# Altium project NODE_Daughter_Board_rev_16.PrjPcb
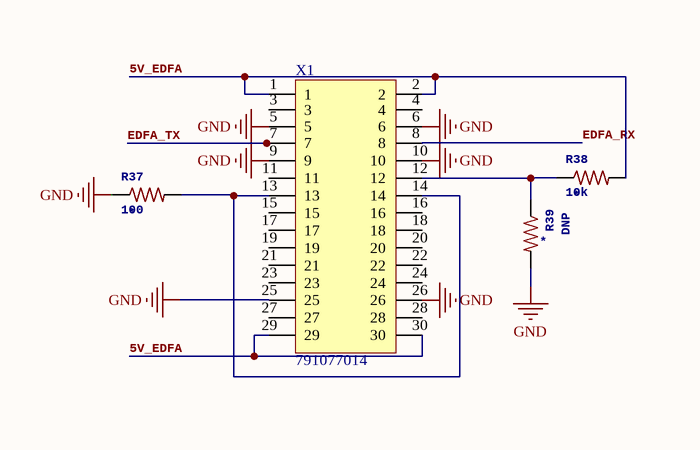
[diagram p0: EDFA Connector.SchDoc]
6 sheets, 213 parts. Net scope: global (net labels, ports and power ports of the same name join across sheets).
Board file: Daughter Board.PcbDoc
Sheets:
  EDFA Connector.SchDoc
  HV Power Supply.SchDoc
  Heater & Cal. Laser.SchDoc
  Seed Laser Controller.SchDoc
  FPGA Connect.SchDoc
  RTDBank.SchDoc

## Sheet EDFA Connector.SchDoc
size 99 x 63 mm

### Parts
R37  100  [0603R]
R38  10k  [0603R]
R39  DNP  [0603R]
X1  791077014  [791077014]

### Nets
GND: R37.1 R39.2 X1.5 X1.6 X1.9 X1.10 X1.25 X1.26
5V_EDFA: R38.2 X1.1 X1.2 X1.29 X1.30
EDFA_RX: X1.8
EDFA_TX: X1.7
NetR37_2: R37.2 X1.13 X1.14
NetR38_1: R38.1 R39.1 X1.12

Not connected (* = marked no-connect by the designer): X1 3 4 11 15 16 17 18 19 20 21 22 23 24 27 28

### Library data of the parts
R37-R39 = R-US_R0603: RESISTOR, American symbol; GateName_1: G$1; SymbolName_1: R-US; DeviceName: R0603; DeviceSetName: R-US_; LibraryName: rcl; NAME: *

## Sheet HV Power Supply.SchDoc
size 333 x 254 mm
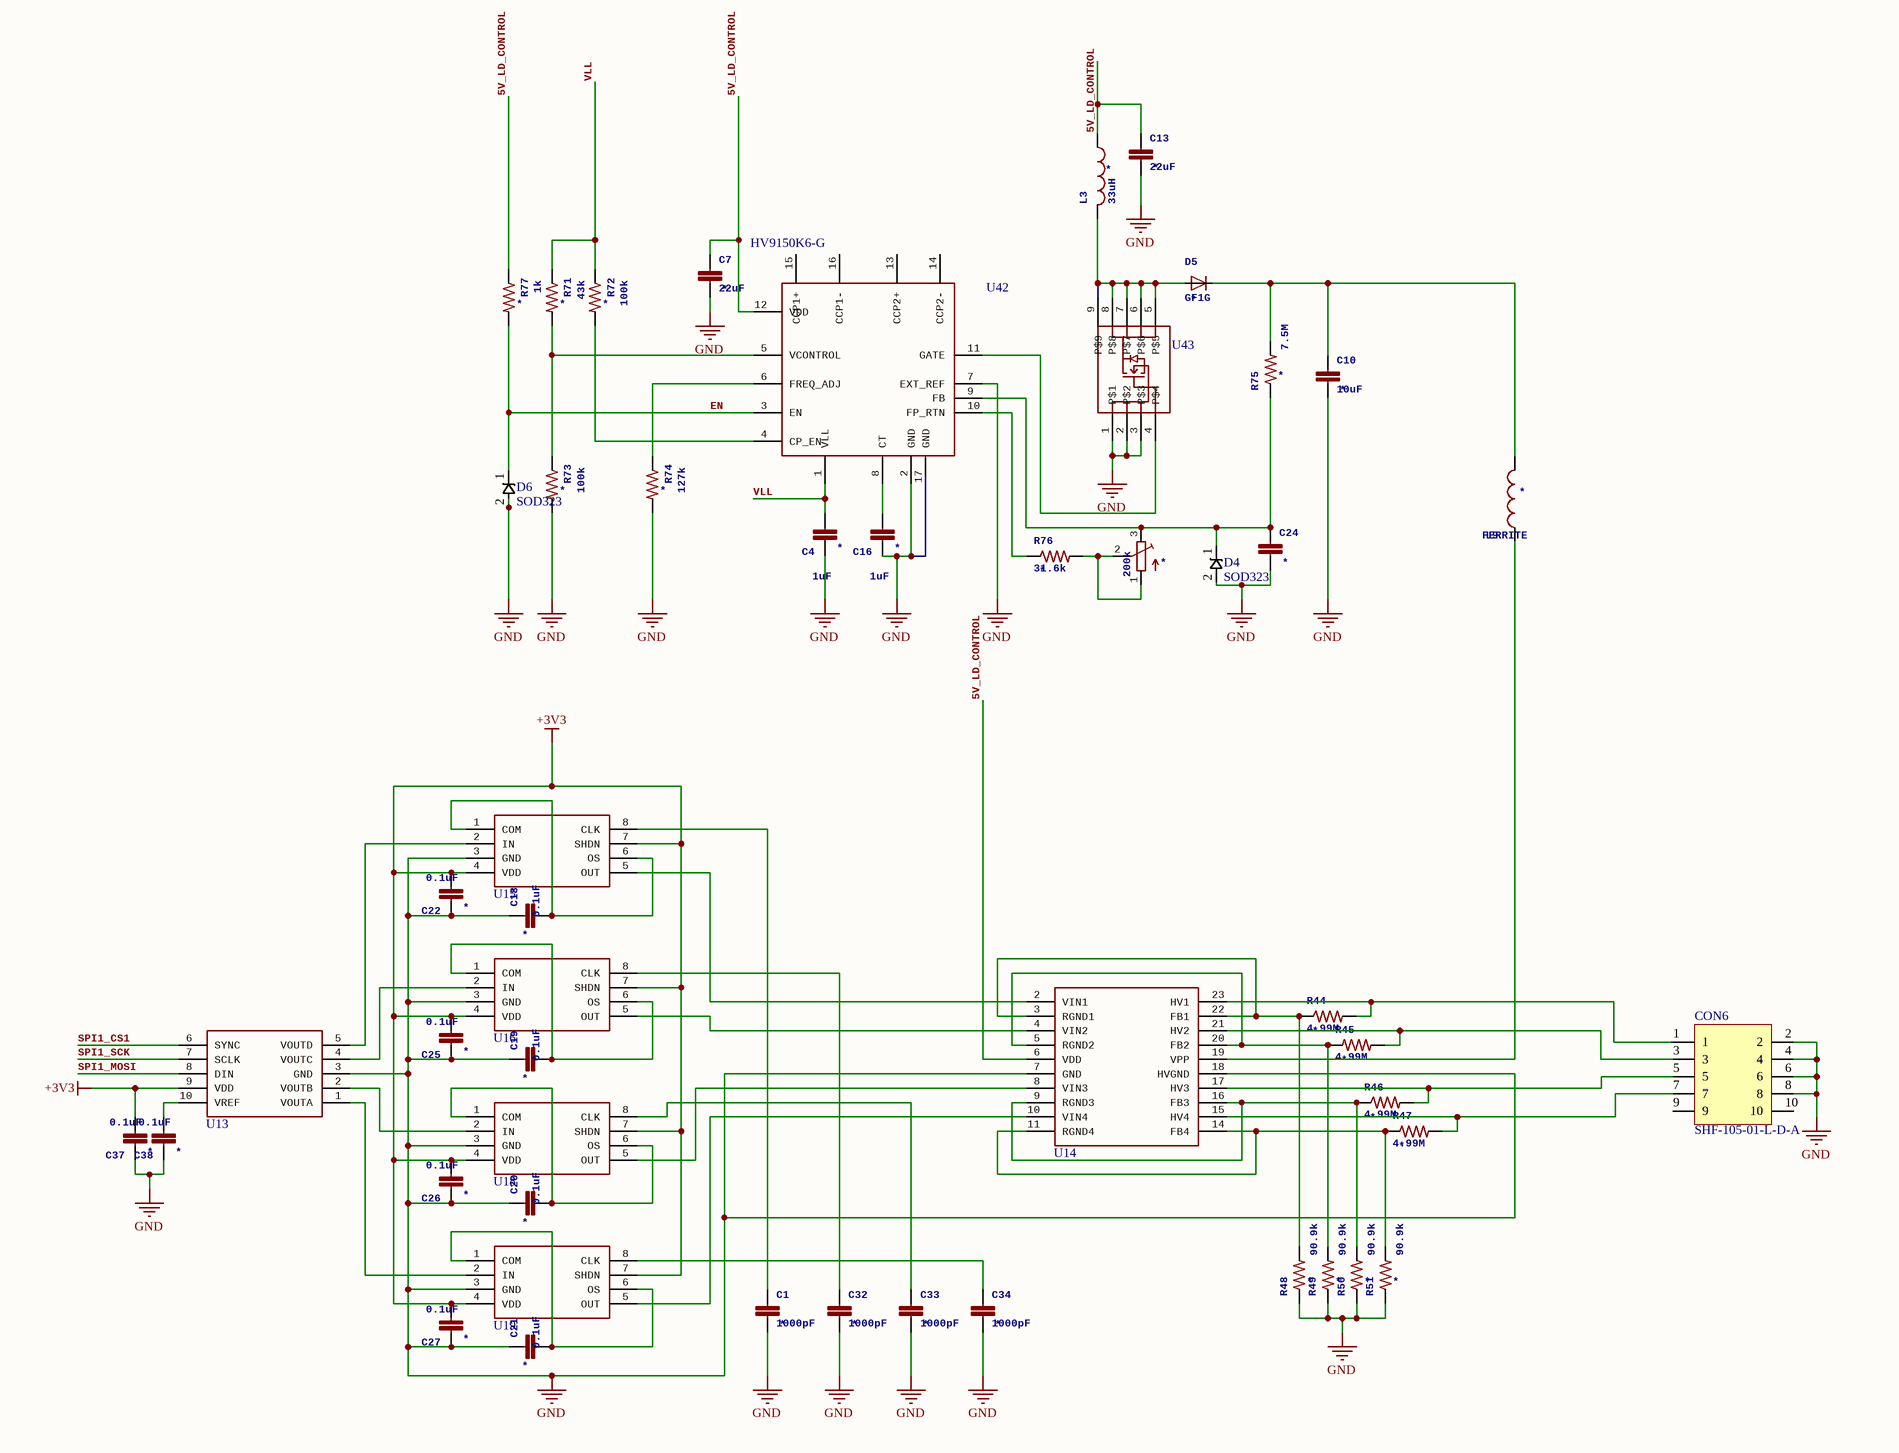
[diagram p1: HV Power Supply.SchDoc]

### Parts
C1  1000pF  [0402 B]
C4  1uF  [0603]
C7  22uF  [0603]
C10  10uF  [C1812]
C13  22uF  [0603]
C16  1uF  [0603]
C18  0.1uF  [0402 B]
C19  0.1uF  [0402 B]
C20  0.1uF  [0402 B]
C21  0.1uF  [0402 B]
C22  0.1uF  [0402 B]
C24  C-EUC0603  [0603]  (value not drawn)
C25  0.1uF  [0402 B]
C26  0.1uF  [0402 B]
C27  0.1uF  [0402 B]
C32  1000pF  [0402 B]
C33  1000pF  [0402 B]
C34  1000pF  [0402 B]
C37  0.1uF  [0402 B]
C38  0.1uF  [0402 B]
CON6  SHF-105-01-L-D-A  [SHF-105-01-L-D-RA]
D4  SOD323  [SOD-323]
D5  GF1G  [DO-214BA]
D6  SOD323  [SOD-323]
L3  33uH  [L1812]
L9  FERRITE  [0603]
R44  4.99M  [0603R]
R45  4.99M  [0603R]
R46  4.99M  [0603R]
R47  4.99M  [0603R]
R48  90.9k  [0603R]
R49  90.9k  [0603R]
R50  90.9k  [0603R]
R51  90.9k  [0603R]
R71  43k  [0603R]
R72  100k  [0603R]
R73  100k  [0603R]
R74  127k  [0603R]
R75  7.5M  [1206R]
R76  31.6k  [0603R]
R77  1k  [0603R]
U13  AD5664R  [MSOP-10]  (value not drawn)
U14  HV264TS-G  [TSSOP-24]  (value not drawn)
U15  MAX7413  [uMAX-8]  (value not drawn)
U16  MAX7413  [uMAX-8]  (value not drawn)
U18  MAX7413  [uMAX-8]  (value not drawn)
U19  MAX7413  [uMAX-8]  (value not drawn)
U42  HV9150K6-G  [QFN-16]
U43  BSZ42DN25NS3GATMA1  [TDSON-8]  (value not drawn)
U44  200k  [TC33X]

### Nets
5V_LD_CONTROL: C7.1 C13.1 L3.1 R77.1 U14.6(VDD) U42.12(VDD)
+3V3: C22.2 C25.2 C26.2 C27.2 C37.2 U13.9(VDD) U15.4(VDD) U15.7(SHDN) U16.4(VDD) U16.7(SHDN) U18.4(VDD) U18.7(SHDN) U19.4(VDD) U19.7(SHDN)
GND: C1.2 C4.1 C7.2 C10.2 C13.2 C16.1 C18.1 C19.1 C20.1 C21.1 C22.1 C24.2 C25.1 C26.1 C27.1 C32.2 C33.2 C34.2 C37.1 C38.1 CON6.2 CON6.4 CON6.6 CON6.8 D4.2 D6.2 R48.1 R49.1 R50.1 R51.1 R73.2 R74.2 U13.3(GND) U14.7(GND) U14.18(HVGND) U15.3(GND) U16.3(GND) U18.3(GND) U19.3(GND) U42.2(GND) U42.7(EXT_REF) U42.17(GND) U43.1(P$1) U43.2(P$2) U43.3(P$3)
EN: D6.1 R77.2 U42.3(EN)
SPI1_CS1: U13.6(SYNC)
SPI1_MOSI: U13.8(DIN)
SPI1_SCK: U13.7(SCLK)
VLL: C4.2 R71.1 R72.1 U42.1(VLL)
NetC1_1: C1.1 U15.8(CLK)
NetC10_1: C10.1 D5.2 L9.2 R75.2
NetC16_2: C16.2 U42.8(CT)
NetC18_2: C18.2 U15.1(COM) U15.6(OS)
NetC19_2: C19.2 U16.1(COM) U16.6(OS)
NetC20_2: C20.2 U18.1(COM) U18.6(OS)
NetC21_2: C21.2 U19.1(COM) U19.6(OS)
NetC24_1: C24.1 D4.1 R75.1 U42.9(FB) U44.3(E)
NetC32_1: C32.1 U16.8(CLK)
NetC33_1: C33.1 U18.8(CLK)
NetC34_1: C34.1 U19.8(CLK)
NetC38_2: C38.2 U13.10(VREF)
NetCON6_1: CON6.1 R44.2 U14.23(HV1)
NetCON6_3: CON6.3 R45.2 U14.21(HV2)
NetCON6_5: CON6.5 R46.2 U14.17(HV3)
NetCON6_7: CON6.7 R47.2 U14.15(HV4)
NetD5_1: D5.1 L3.2 U43.5(P$5) U43.6(P$6) U43.7(P$7) U43.8(P$8) U43.9(P$9)
NetL9_1: L9.1 U14.19(VPP)
NetR44_1: R44.1 R48.2 U14.3(RGND1) U14.22(FB1)
NetR45_1: R45.1 R49.2 U14.5(RGND2) U14.20(FB2)
NetR46_1: R46.1 R50.2 U14.9(RGND3) U14.16(FB3)
NetR47_1: R47.1 R51.2 U14.11(RGND4) U14.14(FB4)
NetR71_2: R71.2 R73.1 U42.5(VCONTROL)
NetR72_2: R72.2 U42.4(CP_EN)
NetR74_1: R74.1 U42.6(FREQ_ADJ)
NetR76_1: R76.1 U42.10(FP_RTN)
NetR76_2: R76.2 U44.1(A) U44.2(S)
NetU13_1: U13.1(VOUTA) U19.2(IN)
NetU13_2: U13.2(VOUTB) U18.2(IN)
NetU13_4: U13.4(VOUTC) U16.2(IN)
NetU13_5: U13.5(VOUTD) U15.2(IN)
NetU14_2: U14.2(VIN1) U15.5(OUT)
NetU14_4: U14.4(VIN2) U16.5(OUT)
NetU14_8: U14.8(VIN3) U18.5(OUT)
NetU14_10: U14.10(VIN4) U19.5(OUT)
NetU42_11: U42.11(GATE) U43.4(P$4)

Not connected (* = marked no-connect by the designer): CON6 9 10; U42 13(CCP2+) 14(CCP2-) 15(CCP1+) 16(CCP1-)

### Library data of the parts
C1 C18-C22 C25-C27 C32-C34 C37 C38 = CAP_0402: 0402 (1005 Metric) Nick Garner - TeleSense; GateName_1: G$1; SymbolName_1: CAP; LibraryName: Perfect_0402; DeviceSetName: CAP_0402; NAME: *
C4 C7 C13 C16 C24 = C-EUC0603: CAPACITOR, European symbol; GateName_1: G$1; SymbolName_1: C-EU; DeviceName: C0603; LibraryName: rcl; DeviceSetName: C-EU; NAME: *
C10 = C-EUC1812: CAPACITOR, European symbol; GateName_1: G$1; SymbolName_1: C-EU; DeviceName: C1812; LibraryName: rcl; DeviceSetName: C-EU; NAME: *
D5 = GF1: DIODE; GateName_1: D; SymbolName_1: D-1; LibraryName: diode; DeviceSetName: GF1; NAME: *
L3 = L-USL1812: INDUCTOR, American symbol; GateName_1: G$1; SymbolName_1: L-US; DeviceName: L1812; LibraryName: resistor; DeviceSetName: L-US; NAME: *
L9 = INDUCTOR30OHM,1.8A: InductorsBasic Inductor/Choke - 0603 and 1206. Footprints are not proven and vary greatly between part numbers.SRN6045- 33uH, 20% 1.4ASDR0403-560KL - 56uH, 10%, 500mA RMS/740mA peak; GateName_1: G$1; PROD_ID: RES-07859; SymbolName_1: INDUCTOR; DeviceName: 30OHM,1.8A; LibraryName: SparkFun-Passives; DeviceSetName: INDUCTOR; NAME: *
R44-R51 R71-R74 R76 R77 = R-US_R0603: as R37 on sheet EDFA Connector; LibraryName: rcl; NAME: *
R75 = R-US_R1206: RESISTOR, American symbol; GateName_1: G$1; SymbolName_1: R-US; DeviceName: R1206; DeviceSetName: R-US_; LibraryName: rcl; NAME: *
U13 = AD5664R: GateName_1: G$1; SymbolName_1: AD5664R; LibraryName: custom; DeviceSetName: AD5664R
U14 = HV264: GateName_1: G$1; SymbolName_1: HV264; LibraryName: custom; DeviceSetName: HV264
U15 U16 U18 U19 = MAX7413: GateName_1: G$1; SymbolName_1: MAX7413; LibraryName: custom; DeviceSetName: MAX7413
U42 = HV9150: GateName_1: G$1; SymbolName_1: HV9150; LibraryName: custom; DeviceSetName: HV9150
U43 = BSZ42DN25NS3: GateName_1: G$1; SymbolName_1: BSZ42DN25NS3; LibraryName: custom; DeviceSetName: BSZ42DN25NS3
U44 = TRIMPOTTC33X: SMT trimmer potentiometer part number TC33X http://www.ladyada.net/library/eagle; GateName_1: G$1; SymbolName_1: TRIMPOT; DeviceName: TC33X; LibraryName: adafruit; DeviceSetName: TRIMPOT; NAME: *

## Sheet Heater & Cal. Laser.SchDoc
size 214 x 146 mm
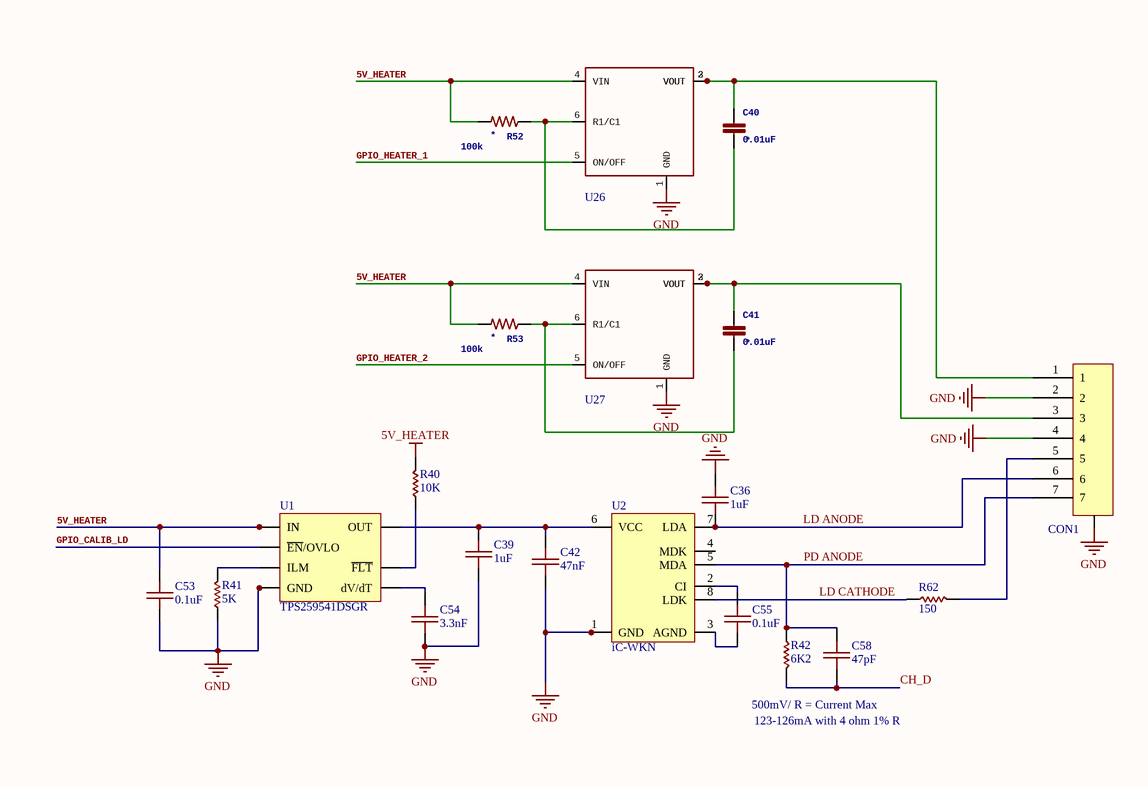
[diagram p2: Heater & Cal. Laser.SchDoc]

### Parts
C36  1uF  [0402 B]
C39  1uF  [0402 B]
C40  0.01uF  [0603]
C41  0.01uF  [0603]
C42  47nF  [0402 B]
C53  0.1uF  [0402 B]
C54  3.3nF  [0402 B]
C55  0.1uF  [0402 B]
C58  47pF  [0402 B]
CON1  T1M-07-F-SH-L-K_1  [T1M-07-F-SH-L-K]  (value not drawn)
R40  10K  [0402]
R41  5K  [0402]
R42  6K2  [0402R]
R52  100k  [0603R]
R53  100k  [0603R]
R62  150  [0402R]
U1  TPS259541DSGR  [SON8 (2x2)]
U2  iC-WKN  [SOIC8tp]
U26  TPS27082L  [TSOT-23 6 Lead]  (value not drawn)
U27  TPS27082L  [TSOT-23 6 Lead]  (value not drawn)

### Nets
5V_HEATER: C53.2 R40.1 R52.2 R53.2 U1.3(IN) U1.4(IN) U26.4(VIN) U27.4(VIN)
GND: C36.2 C39.1 C42.1 C53.1 C54.1 CON1.2 CON1.4 CON1.GND R41.2 U1.8(GND) U1.9 U2.1(GND) U2.9 U26.1(GND) U27.1(GND)
CH_D: C58.1 R42.1
GPIO_CALIB_LD: U1.2(~{EN}/OVLO)
GPIO_HEATER_1: U26.5(ON/OFF)
GPIO_HEATER_2: U27.5(ON/OFF)
LD ANODE: C36.1 CON1.6 U2.7(LDA)
LD CATHODE: R62.2 U2.8(LDK)
PD ANODE: C58.2 CON1.7 R42.2 U2.5(MDA)
NetC39_2: C39.2 C42.2 U1.5(OUT) U2.6(VCC)
NetC40_1: C40.1 CON1.1 U26.2(VOUT) U26.3(VOUT)
NetC40_2: C40.2 R52.1 U26.6(R1/C1)
NetC41_1: C41.1 CON1.3 U27.2(VOUT) U27.3(VOUT)
NetC41_2: C41.2 R53.1 U27.6(R1/C1)
NetC54_2: C54.2 U1.1(dV/dT)
NetC55_1: C55.1 U2.3(AGND)
NetC55_2: C55.2 U2.2(CI)
NetCON1_5: CON1.5 R62.1
NetR40_2: R40.2 U1.6(~{FLT})
NetR41_1: R41.1 U1.7(ILM)

Not connected (* = marked no-connect by the designer): U2 4(MDK)

### Notes on the sheet
- 500mV/ R = Current Max
- 123-126mA with 4 ohm 1% R

### Library data of the parts
C36 C39 C42 C53-C55 C58 = CAP 0402: 402 Capacitor
C40 C41 = C-EUC0603K: CAPACITOR, European symbol; GateName_1: G$1; SymbolName_1: C-EU; DeviceName: C0603K; LibraryName: rcl; DeviceSetName: C-EU; NAME: *
CON1 = T1M-07-F-SH-L-K_1: 6 Positions Header Connector Surface Mount, Right Angle; Manufacturer: Samtec; Manufacturer Part Number: T1M-06-F-SH-L-K; Supplier 1: Digi-Key; Stock 1: 0; Supplier Part Number 1: SAM11991-ND
R40-R42 R62 = RES 0402: 402 Resistor
R52 R53 = R-US_R0603: as R37 on sheet EDFA Connector; LibraryName: rcl; NAME: *
U1 = TPS2595x3
U26 U27 = TPS27082L: GateName_1: G$1; SymbolName_1: TPS27082L; LibraryName: custom; DeviceSetName: TPS27082L

## Sheet Seed Laser Controller.SchDoc
size 267 x 211 mm
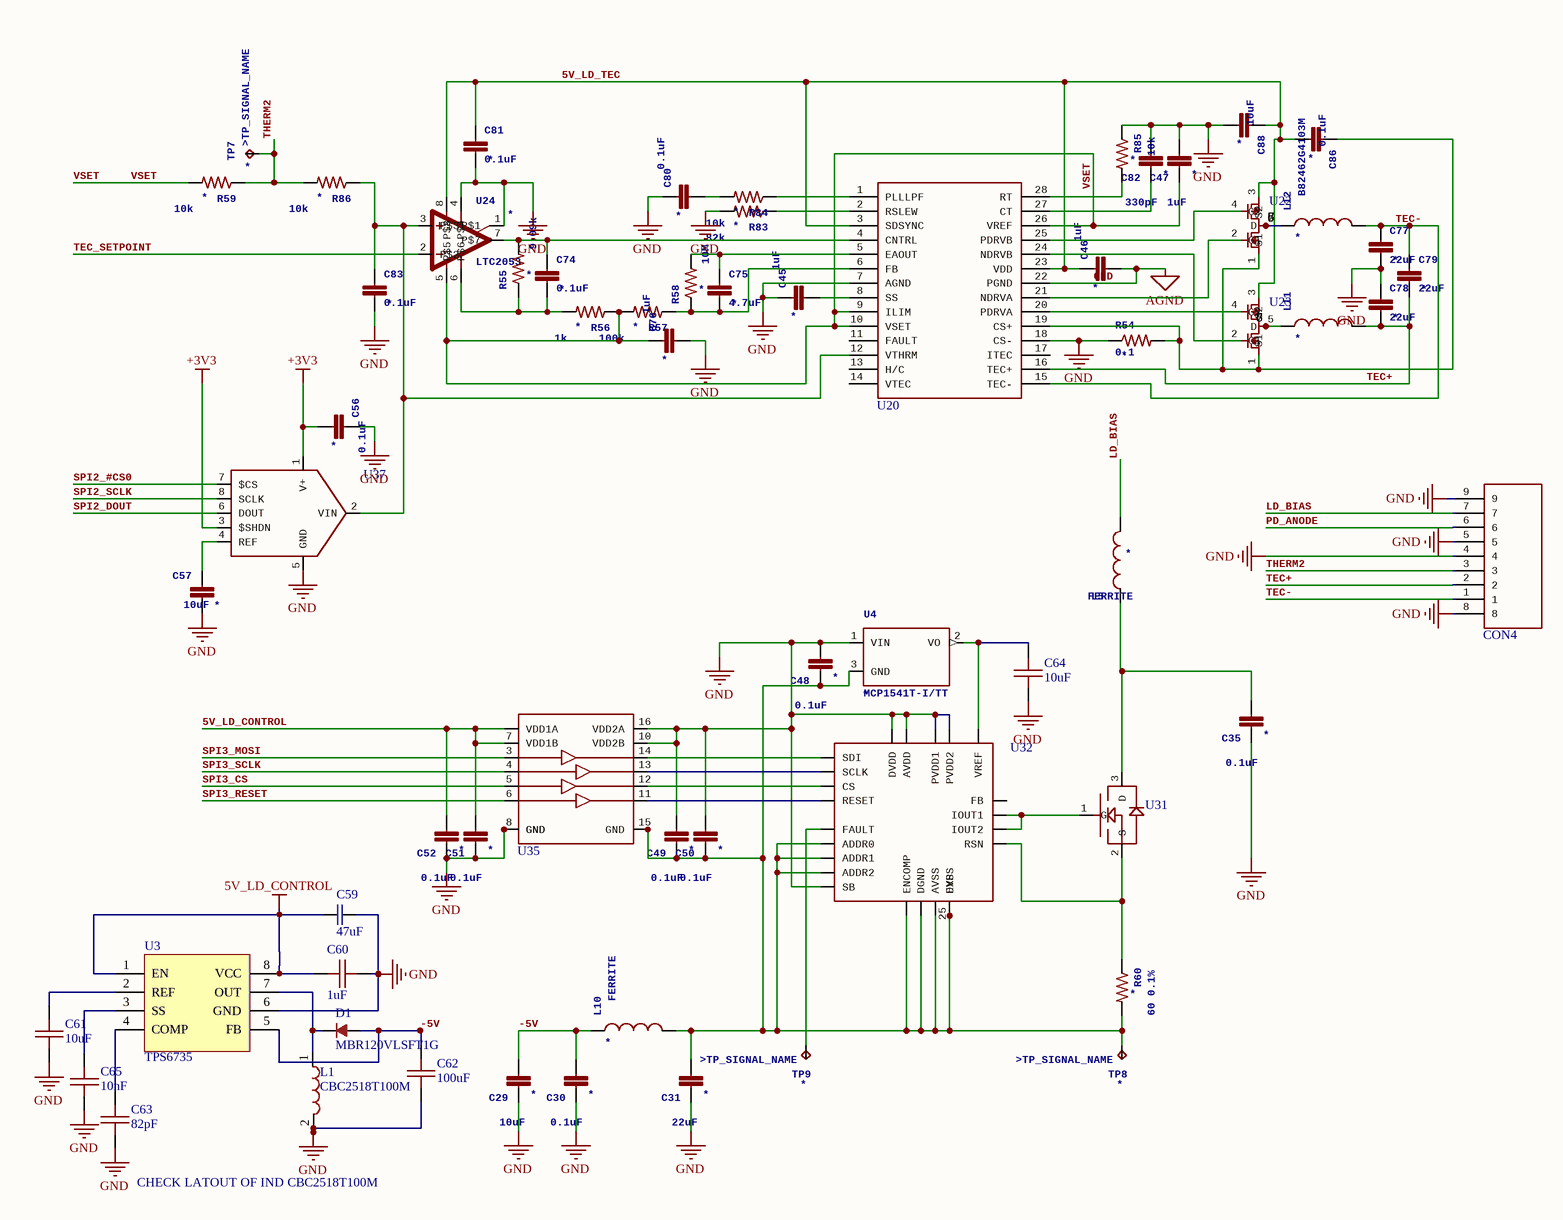
[diagram p3: Seed Laser Controller.SchDoc]

### Parts
C29  10uF  [0603]
C30  0.1uF  [0603]
C31  22uF  [0603]
C35  0.1uF  [0603]
C45  1uF  [0402]
C46  1uF  [0402]
C47  1uF  [0402]
C48  0.1uF  [0402 B]
C49  0.1uF  [0402 B]
C50  0.1uF  [0402 B]
C51  0.1uF  [0402 B]
C52  0.1uF  [0402 B]
C56  0.1uF  [0402]
C57  10uF  [0603]
C59  47uF  [0603]
C60  1uF  [0402 B]
C61  10uF  [0402 B]
C62  100uF  [1206 B]
C63  82pF  [0402 B]
C64  10uF  [0402 B]
C65  10nF  [0402 B]
C74  0.1uF  [0603]
C75  4.7uF  [0603]
C76  1uF  [0402]
C77  22uF  [0402]
C78  22uF  [0402]
C79  22uF  [0603]
C80  0.1uF  [0402]
C81  0.1uF  [0603]
C82  330pF  [0402]
C83  0.1uF  [0402]
C86  0.1uF  [0402]
C88  10uF  [0603]
CON4  SAMTEC_T1M_X7  [T1M-07-F-SH-L-K]  (value not drawn)
D1  MBR120VLSFT1G  [SOD123FL]
L1  CBC2518T100M  [1007]
L5  FERRITE  [0603R]
L10  FERRITE  [0603R]
L11  B82462G4103M  [B82462G]  (value not drawn)
L12  B82462G4103M  [B82462G]
R54  0.1  [1206R]
R55  9.09k  [0603R]
R56  1k  [0603R]
R57  100k  [0603R]
R58  10M  [0603R]
R59  10k  [0603R]
R60  60 0.1%  [0603R]
R83  82k  [0402R]
R84  10k  [0402R]
R85  10k  [0402R]
R86  10k  [0603R]
TP7  TP_SIGNAL_NAME: >TP_SIGNAL_NAME  [B1,27]  (hidden comment: TPB1,27)
TP8  TP_SIGNAL_NAME: >TP_SIGNAL_NAME  [B1,27]  (hidden comment: TPB1,27)
TP9  TP_SIGNAL_NAME: >TP_SIGNAL_NAME  [B1,27]  (hidden comment: TPB1,27)
U3  TPS6735  [SOIC8]
U4  MCP1541T-I/TT  [SOT-23]
U20  LTC1923SSOP28  [SSOP-28]  (value not drawn)
U22  SI9801DY  [SOIC8]  (value not drawn)
U23  SI9801DY  [SOIC8]  (value not drawn)
U24  LTC2053  [MSOP8]
U31  SI2334DS  [SOT-23]  (value not drawn)
U32  ADN8810ACPZ  [LFCSP-24]  (value not drawn)
U35  ADUM7440  [QSOP16]  (value not drawn)
U37  MAX1240  [SOIC8]  (value not drawn)

### Nets
5V_LD_CONTROL: C51.2 C52.2 C59.1 C60.2 U3.1(EN) U3.8(VCC) U35.1(VDD1A) U35.7(VDD1B)
+3V3: C56.2 U37.1(V+) U37.3($SHDN)
GND: C29.1 C30.1 C31.1 C35.1 C45.1 C46.2 C47.2 C48.2 C49.2 C50.2 C51.1 C52.1 C56.1 C57.2 C59.2 C60.1 C61.1 C62.1 C63.1 C64.1 C65.1 C76.2 C77.2 C78.1 C80.1 C81.2 C82.2 C83.2 C88.2 CON4.4 CON4.5 CON4.8 CON4.9 L1.2 R54.1 R83.2 R85.1 U3.6(GND) U4.1(VIN) U20.7(AGND) U20.18(CS-) U20.22(PGND) U24.1(P$1) U24.4(P$4) U32.7(SB) U32.8(PVDD1) U32.11(PVDD2) U32.15(AVDD) U32.23(DVDD) U35.2(GND) U35.8(GND) U35.10(VDD2B) U35.16(VDD2A) U37.5(GND)  [also labelled AGND]
5V_LD_TEC: C46.1 C81.1 C86.2 C88.1 U20.3(SDSYNC) U20.23(VDD) U22.3(S2) U23.3(S2) U24.8(P$8)
-5V: C29.2 C30.2 C62.2 D1.2(A) L10.1 U3.5(FB)
LD_BIAS: CON4.7 L5.2
PD_ANODE: CON4.6
SPI2_#CS0: U37.7($CS)
SPI2_DOUT: U37.6(DOUT)
SPI2_SCLK: U37.8(SCLK)
SPI3_CS: U35.5(P$5)
SPI3_MOSI: U35.3(P$3)
SPI3_RESET: U35.6(P$6)
SPI3_SCLK: U35.4(P$4)
TEC+: C78.2 C79.2 CON4.2 L11.P$2 U20.16(TEC+)
TEC-: C77.1 C79.1 CON4.1 L12.P$2 U20.15(TEC-)
TEC_SETPOINT: U24.2(P$2)
THERM2: CON4.3 R59.1 R86.2 TP7.TP
VSET: C47.1 C76.1 R56.1 R57.2 R59.2 U20.9(ILIM) U20.10(VSET) U20.26(VREF) U24.5(P$5)
NetC31_2: C31.2 C48.1 C49.1 C50.1 L10.2 R60.2 TP8.TP U4.3(GND) U32.1(ADDR2) U32.4(ADDR1) U32.5(ADDR0) U32.12(ENCOMP) U32.16(AVSS) U32.18(DVSS) U32.24(DGND) U32.25(EXP) U35.9(GND) U35.15(GND)
NetC35_2: C35.2 L5.1 U31.3(D)
NetC45_2: C45.2 U20.8(SS)
NetC57_1: C57.1 U37.4(REF)
NetC61_2: C61.2 U3.2(REF)
NetC63_2: C63.2 U3.4(COMP)
NetC64_2: C64.2 U4.2(VO) U32.14(VREF)
NetC65_2: C65.2 U3.3(SS)
NetC74_1: C74.1 R55.2 U20.4(CNTRL) U24.7(P$7)
NetC74_2: C74.2 R55.1 R56.2 U24.6(P$6)
NetC75_1: C75.1 R58.2 U20.5(EAOUT)
NetC75_2: C75.2 R57.1 R58.1 U20.6(FB)
NetC80_2: C80.2 R84.2
NetC82_1: C82.1 U20.27(CT)
NetC83_1: C83.1 R86.1 U20.12(VTHRM) U24.3(P$3) U37.2(VIN)
NetC86_1: C86.1 R54.2 U20.19(CS+) U22.1(S1) U23.1(S1)
NetD1_1: D1.1(K) L1.1 U3.7(OUT)
NetL11_P$1: L11.P$1 U23.5(D) U23.6(D) U23.7(D) U23.8(D)
NetL12_P$1: L12.P$1 U22.5(D) U22.6(D) U22.7(D) U22.8(D)
NetR60_1: R60.1 U31.2(S) U32.2(RSN)
NetR83_1: R83.1 U20.2(RSLEW)
NetR84_1: R84.1 U20.1(PLLLPF)
NetR85_2: R85.2 U20.28(RT)
NetTP9_TP: TP9.TP U32.6(FAULT)
NetU20_20: U20.20(PDRVA) U23.4(G2)
NetU20_21: U20.21(NDRVA) U22.2(G1)
NetU20_24: U20.24(NDRVB) U23.2(G1)
NetU20_25: U20.25(PDRVB) U22.4(G2)
NetU31_1: U31.1(G) U32.9(IOUT1) U32.10(IOUT2)
NetU32_19: U32.19(SDI) U35.14(P$14)
NetU32_20: U32.20(SCLK) U35.13(P$13)
NetU32_21: U32.21(CS) U35.12(P$12)
NetU32_22: U32.22(RESET) U35.11(P$11)

Not connected (* = marked no-connect by the designer): U20 11(FAULT) 13(H/C) 14(VTEC) 17(ITEC); U32 3(FB)

### Notes on the sheet
- CHECK LATOUT OF IND CBC2518T100M

### Library data of the parts
C29-C31 C35 C57 C88 = C-EUC0603K: as C40 on sheet Heater & Cal. Laser; LibraryName: rcl; DeviceSetName: C-EU; NAME: *
C45-C52 C76-C78 C80-C83 C86 = C-EUC0402: CAPACITOR, European symbol; GateName_1: G$1; SymbolName_1: C-EU; DeviceName: C0402; LibraryName: rcl; DeviceSetName: C-EU; NAME: *
C56 = C-EUC0402K: CAPACITOR, European symbol; GateName_1: G$1; SymbolName_1: C-EU; DeviceName: C0402K; LibraryName: rcl; DeviceSetName: C-EU; NAME: *
C59 = Cap 0603
C60 C61 C63-C65 = CAP 0402: 402 Capacitor
C62 = CAP 1206: 1206 Capacitor
C74 C75 C79 = C-EUC0603: as C4 on sheet HV Power Supply; LibraryName: rcl; DeviceSetName: C-EU; NAME: *
CON4 = SAMTEC_T1M_X7: GateName_1: G$1; SymbolName_1: SAMTEC_T1M_X7; LibraryName: custom; DeviceSetName: SAMTEC_T1M_X7
D1 = MBR120VLSFT1G: DIODE SCHOTTKY 20V 1A
L5 L10 = INDUCTOR0603: InductorsBasic Inductor/Choke - 0603 and 1206. Footprints are not proven and vary greatly between part numbers.SRN6045- 33uH, 20% 1.4ASDR0403-560KL - 56uH, 10%, 500mA RMS/740mA peak; GateName_1: G$1; DeviceName: 0603; SymbolName_1: INDUCTOR; LibraryName: SparkFun-Passives; DeviceSetName: INDUCTOR; NAME: *
L11 L12 = INDUCTOR-B82462G: 10uH; GateName_1: G$1; SymbolName_1: INDUCTOR; DeviceName: -B82462G; LibraryName: SparkFun-Passives; DeviceSetName: INDUCTOR; NAME: *
R54 = R-US_R1206: as R75 on sheet HV Power Supply; LibraryName: rcl; NAME: *
R55-R60 R86 = R-US_R0603: as R37 on sheet EDFA Connector; LibraryName: rcl; NAME: *
R83-R85 = R-US_R0402: RESISTOR, American symbol; GateName_1: G$1; SymbolName_1: R-US; DeviceName: R0402; DeviceSetName: R-US_; LibraryName: rcl; NAME: *
TP7-TP9 = TPB1,27: Test pad; GateName_1: G$1; SymbolName_1: TP; DeviceName: B1,27; LibraryName: testpad; DeviceSetName: TP; NAME: *
U4 = MC15*TT: 2.5V and 4.096V Voltage ReferencesSource: http://www.microchip.com .. 21653b.pdf; GateName_1: G$1; SymbolName_1: MCP1525; DeviceName: TT; DeviceSetName: MC15*; LibraryName: microchip; MF: *; MPN: *; NAME: *; OC_FARNELL: unknown; OC_NEWARK: unknown
U20 = LTC1923SSOP28: GateName_1: G$1; DeviceName: SSOP28; SymbolName_1: LTC1923; LibraryName: custom; DeviceSetName: LTC1923
U22 U23 = SI9801DY: GateName_1: G$1; SymbolName_1: SI9801DY; LibraryName: custom; DeviceSetName: SI9801DY
U24 = LTC2053: GateName_1: G$1; SymbolName_1: LTC2053; LibraryName: custom; DeviceSetName: LTC2053; NAME: *
U31 = SI2334DS: GateName_1: G$1; SymbolName_1: N-CHANNEL; LibraryName: custom; DeviceSetName: SI2334DS
U32 = ADN8810: GateName_1: G$1; SymbolName_1: ADN8810; LibraryName: custom; DeviceSetName: ADN8810
U35 = ADUM7440: GateName_1: G$1; SymbolName_1: ADUM7440; LibraryName: custom; DeviceSetName: ADUM7440
U37 = MAX1240: GateName_1: G$1; SymbolName_1: MAX1240; LibraryName: custom; DeviceSetName: MAX1240

## Sheet FPGA Connect.SchDoc
size B
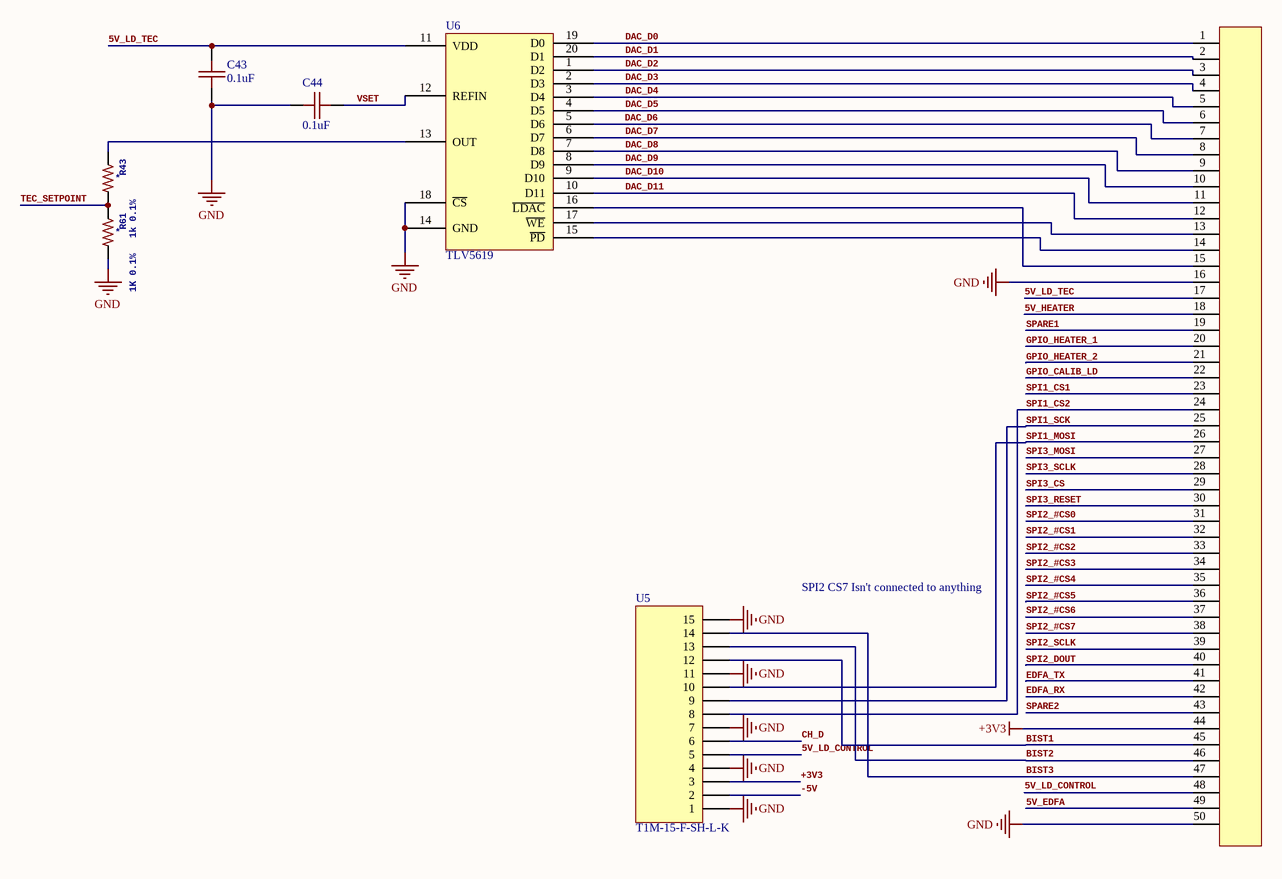
[diagram p4: FPGA Connect.SchDoc]

### Parts
C43  0.1uF  [0402 B]
C44  0.1uF  [0402 B]
CON5  (no value)  [LSEM-150-XX.X-X-DV-A-X-XX-TR]
R43  1k 0.1%  [0402R]
R61  1K 0.1%  [0402R]
U5  T1M-15-F-SH-L-K  [T1M-15-F-SH-L-K]
U6  TLV5619  [TSSOP-20]

### Nets
5V_HEATER: CON5.18
5V_LD_CONTROL: CON5.48 U5.5
+3V3: CON5.44 U5.3
GND: C43.2 C44.2 CON5.16 CON5.50 R61.2 U5.1 U5.4 U5.7 U5.11 U5.15 U6.14(GND) U6.18(~{CS})
5V_EDFA: CON5.49
5V_LD_TEC: C43.1 CON5.17 U6.11(VDD)
-5V: U5.2
BIST1: CON5.45 U5.12
BIST2: CON5.46 U5.13
BIST3: CON5.47 U5.14
CH_D: U5.6
DAC_D0: CON5.1 U6.19(D0)
DAC_D1: CON5.2 U6.20(D1)
DAC_D2: CON5.3 U6.1(D2)
DAC_D3: CON5.4 U6.2(D3)
DAC_D4: CON5.5 U6.3(D4)
DAC_D5: CON5.6 U6.4(D5)
DAC_D6: CON5.7 U6.5(D6)
DAC_D7: CON5.8 U6.6(D7)
DAC_D8: CON5.9 U6.7(D8)
DAC_D9: CON5.10 U6.8(D9)
DAC_D10: CON5.11 U6.9(D10)
DAC_D11: CON5.12 U6.10(D11)
EDFA_RX: CON5.42
EDFA_TX: CON5.41
GPIO_CALIB_LD: CON5.22
GPIO_HEATER_1: CON5.20
GPIO_HEATER_2: CON5.21
SPARE1: CON5.19
SPARE2: CON5.43
SPI1_CS1: CON5.23
SPI1_CS2: CON5.24 U5.8
SPI1_MOSI: CON5.26 U5.10
SPI1_SCK: CON5.25 U5.9
SPI2_#CS0: CON5.31
SPI2_#CS1: CON5.32
SPI2_#CS2: CON5.33
SPI2_#CS3: CON5.34
SPI2_#CS4: CON5.35
SPI2_#CS5: CON5.36
SPI2_#CS6: CON5.37
SPI2_#CS7: CON5.38
SPI2_DOUT: CON5.40
SPI2_SCLK: CON5.39
SPI3_CS: CON5.29
SPI3_MOSI: CON5.27
SPI3_RESET: CON5.30
SPI3_SCLK: CON5.28
TEC_SETPOINT: R43.2 R61.1
VSET: C44.1 U6.12(REFIN)
NetCON5_13: CON5.13 U6.17(~{WE})
NetCON5_14: CON5.14 U6.15(~{PD})
NetCON5_15: CON5.15 U6.16(~{LDAC})
NetR43_1: R43.1 U6.13(OUT)

### Notes on the sheet
- SPI2 CS7 Isn't connected to anything

### Library data of the parts
C43 C44 = CAP 0402: 402 Capacitor
CON5 = SAMTEC_LSEM_V_50: SAMTEC connector SAMTEC_LSEM_V_50
R43 R61 = R-US_R0603: as R37 on sheet EDFA Connector; LibraryName: rcl; NAME: *

## Sheet RTDBank.SchDoc
size 155 x 512 mm
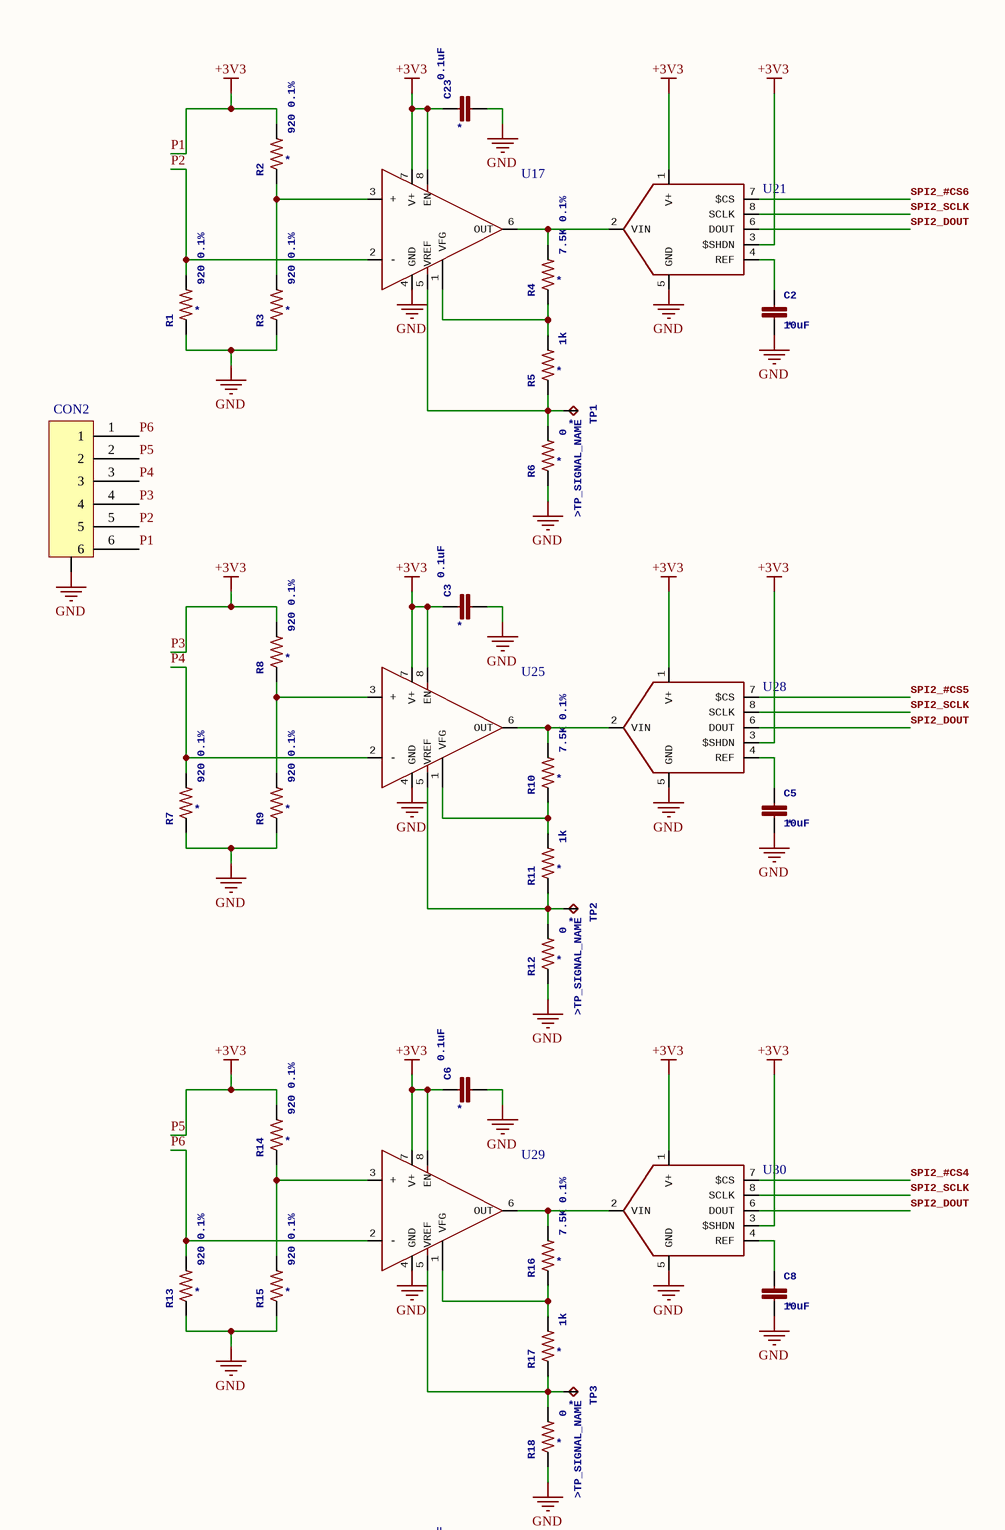
[diagram p5: RTDBank.SchDoc, top]
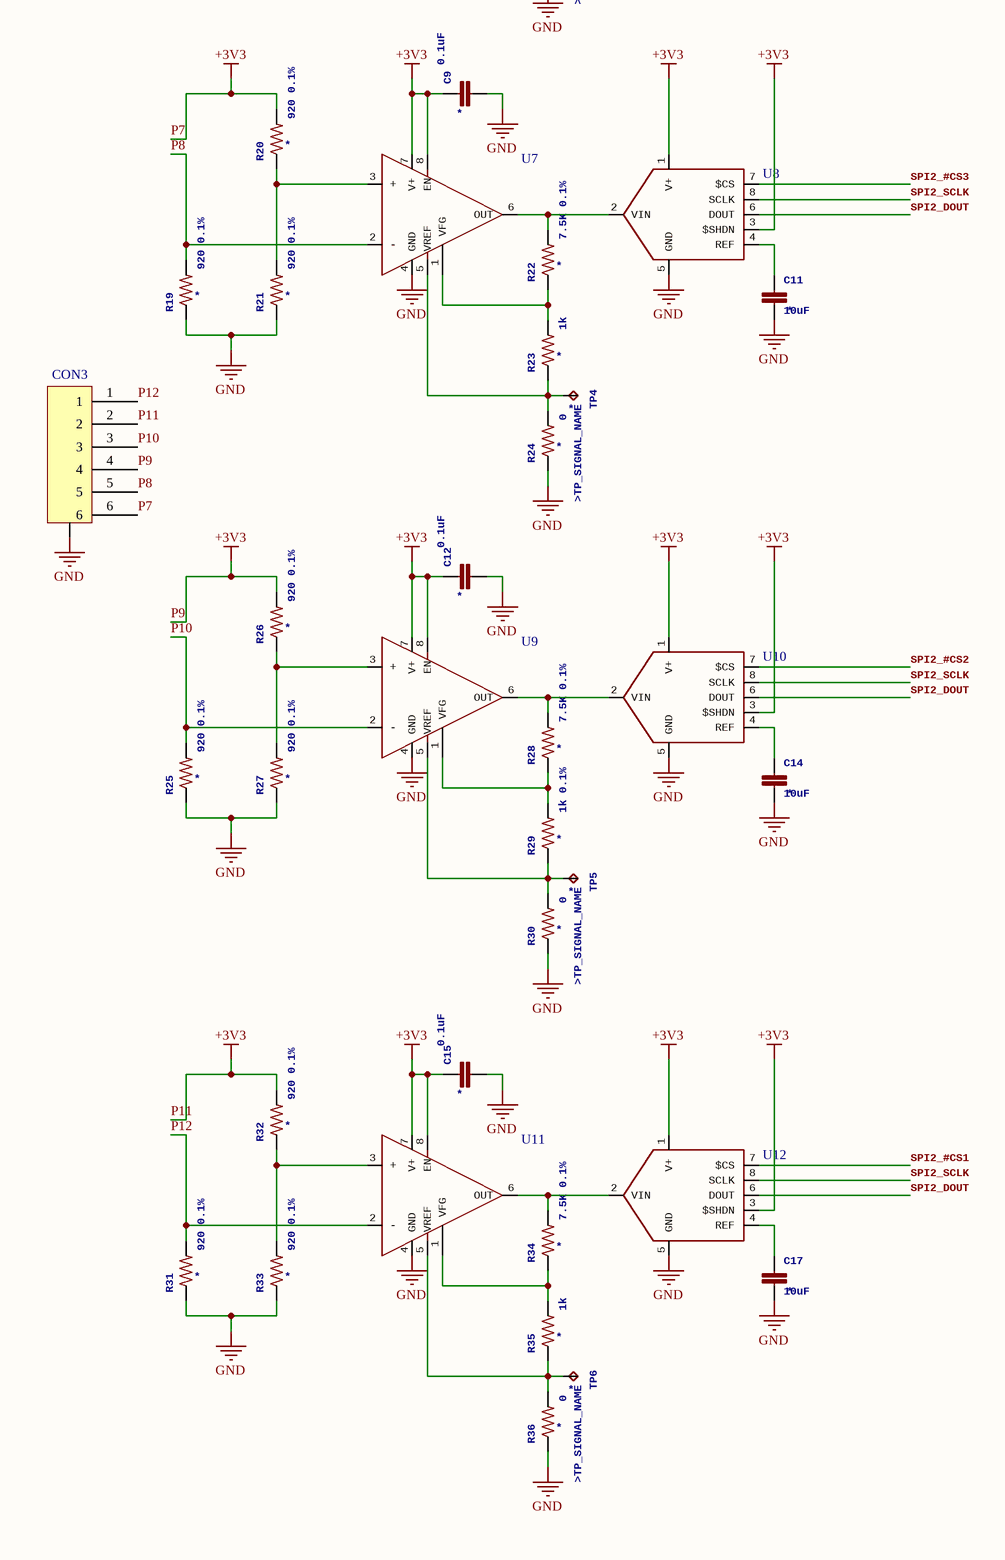
[diagram p6: RTDBank.SchDoc, bottom]

### Parts
C2  10uF  [0603]
C3  0.1uF  [0402 B]
C5  10uF  [0603]
C6  0.1uF  [0402 B]
C8  10uF  [0603]
C9  0.1uF  [0402 B]
C11  10uF  [0603]
C12  0.1uF  [0402 B]
C14  10uF  [0603]
C15  0.1uF  [0402 B]
C17  10uF  [0603]
C23  0.1uF  [0402 B]
CON2  T1M-06-F-SH-L-K  [T1M-06-F-SH-L-K]  (value not drawn)
CON3  T1M-06-F-SH-L-K  [T1M-06-F-SH-L-K]  (value not drawn)
R1  920 0.1%  [0603R]
R2  920 0.1%  [0603R]
R3  920 0.1%  [0603R]
R4  7.5K 0.1%  [0603R]
R5  1k  [0603R]
R6  0  [0603R]
R7  920 0.1%  [0603R]
R8  920 0.1%  [0603R]
R9  920 0.1%  [0603R]
R10  7.5K 0.1%  [0603R]
R11  1k  [0603R]
R12  0  [0603R]
R13  920 0.1%  [0603R]
R14  920 0.1%  [0603R]
R15  920 0.1%  [0603R]
R16  7.5K 0.1%  [0603R]
R17  1k  [0603R]
R18  0  [0603R]
R19  920 0.1%  [0603R]
R20  920 0.1%  [0603R]
R21  920 0.1%  [0603R]
R22  7.5K 0.1%  [0603R]
R23  1k  [0603R]
R24  0  [0603R]
R25  920 0.1%  [0603R]
R26  920 0.1%  [0603R]
R27  920 0.1%  [0603R]
R28  7.5K 0.1%  [0603R]
R29  1k 0.1%  [0603R]
R30  0  [0603R]
R31  920 0.1%  [0603R]
R32  920 0.1%  [0603R]
R33  920 0.1%  [0603R]
R34  7.5K 0.1%  [0603R]
R35  1k  [0603R]
R36  0  [0603R]
TP1  TP_SIGNAL_NAME: >TP_SIGNAL_NAME  [B1,27]  (hidden comment: TPB1,27)
TP2  TP_SIGNAL_NAME: >TP_SIGNAL_NAME  [B1,27]  (hidden comment: TPB1,27)
TP3  TP_SIGNAL_NAME: >TP_SIGNAL_NAME  [B1,27]  (hidden comment: TPB1,27)
TP4  TP_SIGNAL_NAME: >TP_SIGNAL_NAME  [B1,27]  (hidden comment: TPB1,27)
TP5  TP_SIGNAL_NAME: >TP_SIGNAL_NAME  [B1,27]  (hidden comment: TPB1,27)
TP6  TP_SIGNAL_NAME: >TP_SIGNAL_NAME  [B1,27]  (hidden comment: TPB1,27)
U7  MCP6N11  [SOIC8]  (value not drawn)
U8  MAX1240  [SOIC8]  (value not drawn)
U9  MCP6N11  [SOIC8]  (value not drawn)
U10  MAX1240  [SOIC8]  (value not drawn)
U11  MCP6N11  [SOIC8]  (value not drawn)
U12  MAX1240  [SOIC8]  (value not drawn)
U17  MCP6N11  [SOIC8]  (value not drawn)
U21  MAX1240  [SOIC8]  (value not drawn)
U25  MCP6N11  [SOIC8]  (value not drawn)
U28  MAX1240  [SOIC8]  (value not drawn)
U29  MCP6N11  [SOIC8]  (value not drawn)
U30  MAX1240  [SOIC8]  (value not drawn)

### Nets
+3V3: C3.1 C6.1 C9.1 C12.1 C15.1 C23.1 CON2.2 CON2.4 CON2.6 CON3.2 CON3.4 CON3.6 R2.2 R8.2 R14.2 R20.2 R26.2 R32.2 U7.7(V+) U7.8(EN) U8.1(V+) U8.3($SHDN) U9.7(V+) U9.8(EN) U10.1(V+) U10.3($SHDN) U11.7(V+) U11.8(EN) U12.1(V+) U12.3($SHDN) U17.7(V+) U17.8(EN) U21.1(V+) U21.3($SHDN) U25.7(V+) U25.8(EN) U28.1(V+) U28.3($SHDN) U29.7(V+) U29.8(EN) U30.1(V+) U30.3($SHDN)  [also labelled P1, P11, P3, P5, P7, P9]
GND: C2.2 C3.2 C5.2 C6.2 C8.2 C9.2 C11.2 C12.2 C14.2 C15.2 C17.2 C23.2 CON2.GND CON3.GND R1.1 R3.1 R6.1 R7.1 R9.1 R12.1 R13.1 R15.1 R18.1 R19.1 R21.1 R24.1 R25.1 R27.1 R30.1 R31.1 R33.1 R36.1 U7.4(GND) U8.5(GND) U9.4(GND) U10.5(GND) U11.4(GND) U12.5(GND) U17.4(GND) U21.5(GND) U25.4(GND) U28.5(GND) U29.4(GND) U30.5(GND)
P2: CON2.5 R1.2 U17.2(-)
P4: CON2.3 R7.2 U25.2(-)
P6: CON2.1 R13.2 U29.2(-)
P8: CON3.5 R19.2 U7.2(-)
P10: CON3.3 R25.2 U9.2(-)
P12: CON3.1 R31.2 U11.2(-)
SPI2_#CS1: U12.7($CS)
SPI2_#CS2: U10.7($CS)
SPI2_#CS3: U8.7($CS)
SPI2_#CS4: U30.7($CS)
SPI2_#CS5: U28.7($CS)
SPI2_#CS6: U21.7($CS)
SPI2_DOUT: U8.6(DOUT) U10.6(DOUT) U12.6(DOUT) U21.6(DOUT) U28.6(DOUT) U30.6(DOUT)
SPI2_SCLK: U8.8(SCLK) U10.8(SCLK) U12.8(SCLK) U21.8(SCLK) U28.8(SCLK) U30.8(SCLK)
NetC2_1: C2.1 U21.4(REF)
NetC5_1: C5.1 U28.4(REF)
NetC8_1: C8.1 U30.4(REF)
NetC11_1: C11.1 U8.4(REF)
NetC14_1: C14.1 U10.4(REF)
NetC17_1: C17.1 U12.4(REF)
NetR2_1: R2.1 R3.2 U17.3(+)
NetR4_1: R4.1 R5.2 U17.1(VFG)
NetR4_2: R4.2 U17.6(OUT) U21.2(VIN)
NetR5_1: R5.1 R6.2 TP1.TP U17.5(VREF)
NetR8_1: R8.1 R9.2 U25.3(+)
NetR10_1: R10.1 R11.2 U25.1(VFG)
NetR10_2: R10.2 U25.6(OUT) U28.2(VIN)
NetR11_1: R11.1 R12.2 TP2.TP U25.5(VREF)
NetR14_1: R14.1 R15.2 U29.3(+)
NetR16_1: R16.1 R17.2 U29.1(VFG)
NetR16_2: R16.2 U29.6(OUT) U30.2(VIN)
NetR17_1: R17.1 R18.2 TP3.TP U29.5(VREF)
NetR20_1: R20.1 R21.2 U7.3(+)
NetR22_1: R22.1 R23.2 U7.1(VFG)
NetR22_2: R22.2 U7.6(OUT) U8.2(VIN)
NetR23_1: R23.1 R24.2 TP4.TP U7.5(VREF)
NetR26_1: R26.1 R27.2 U9.3(+)
NetR28_1: R28.1 R29.2 U9.1(VFG)
NetR28_2: R28.2 U9.6(OUT) U10.2(VIN)
NetR29_1: R29.1 R30.2 TP5.TP U9.5(VREF)
NetR32_1: R32.1 R33.2 U11.3(+)
NetR34_1: R34.1 R35.2 U11.1(VFG)
NetR34_2: R34.2 U11.6(OUT) U12.2(VIN)
NetR35_1: R35.1 R36.2 TP6.TP U11.5(VREF)

### Library data of the parts
C2 C5 C8 C11 C14 C17 = C-EUC0603K: as C40 on sheet Heater & Cal. Laser; LibraryName: rcl; DeviceSetName: C-EU; NAME: *
C3 C6 C9 C12 C15 C23 = C-EUC0402K: as C56 on sheet Seed Laser Controller; LibraryName: rcl; DeviceSetName: C-EU; NAME: *
CON2 CON3 = T1M-06-F-SH-L-K: 6 Positions Header Connector Surface Mount, Right Angle; Manufacturer: Samtec; Supplier 1: Digi-Key; Manufacturer Part Number: T1M-06-F-SH-L-K; Stock 1: 0; Supplier Part Number 1: SAM11991-ND
R1-R36 = R-US_R0603: as R37 on sheet EDFA Connector; LibraryName: rcl; NAME: *
TP1-TP6 = TPB1,27: as TP7 on sheet Seed Laser Controller; DeviceName: B1,27; LibraryName: testpad; DeviceSetName: TP; NAME: *
U7 U9 U11 U17 U25 U29 = MCP6N11: GateName_1: G$1; SymbolName_1: MCP6N11; LibraryName: custom; DeviceSetName: MCP6N11
U8 U10 U12 U21 U28 U30 = MAX1240: GateName_1: G$1; SymbolName_1: MAX1240; LibraryName: custom; DeviceSetName: MAX1240

## Nets that join several sheets
5V_HEATER: Heater & Cal. Laser (8 pins), FPGA Connect (CON5.18)
5V_LD_CONTROL: HV Power Supply (6 pins), Seed Laser Controller (8 pins), FPGA Connect (CON5.48 U5.5)
+3V3: HV Power Supply (14 pins), Seed Laser Controller (C56.2 U37.1 U37.3), FPGA Connect (CON5.44 U5.3), RTDBank (42 pins)
GND: EDFA Connector (8 pins), HV Power Supply (45 pins), Heater & Cal. Laser (15 pins), Seed Laser Controller (54 pins), FPGA Connect (12 pins), RTDBank (44 pins)
5V_EDFA: EDFA Connector (5 pins), FPGA Connect (CON5.49)
5V_LD_TEC: Seed Laser Controller (9 pins), FPGA Connect (C43.1 CON5.17 U6.11)
-5V: Seed Laser Controller (6 pins), FPGA Connect (U5.2)
CH_D: Heater & Cal. Laser (C58.1 R42.1), FPGA Connect (U5.6)
EDFA_RX: EDFA Connector (X1.8), FPGA Connect (CON5.42)
EDFA_TX: EDFA Connector (X1.7), FPGA Connect (CON5.41)
GPIO_CALIB_LD: Heater & Cal. Laser (U1.2), FPGA Connect (CON5.22)
GPIO_HEATER_1: Heater & Cal. Laser (U26.5), FPGA Connect (CON5.20)
GPIO_HEATER_2: Heater & Cal. Laser (U27.5), FPGA Connect (CON5.21)
SPI1_CS1: HV Power Supply (U13.6), FPGA Connect (CON5.23)
SPI1_MOSI: HV Power Supply (U13.8), FPGA Connect (CON5.26 U5.10)
SPI1_SCK: HV Power Supply (U13.7), FPGA Connect (CON5.25 U5.9)
SPI2_#CS0: Seed Laser Controller (U37.7), FPGA Connect (CON5.31)
SPI2_#CS1: FPGA Connect (CON5.32), RTDBank (U12.7)
SPI2_#CS2: FPGA Connect (CON5.33), RTDBank (U10.7)
SPI2_#CS3: FPGA Connect (CON5.34), RTDBank (U8.7)
SPI2_#CS4: FPGA Connect (CON5.35), RTDBank (U30.7)
SPI2_#CS5: FPGA Connect (CON5.36), RTDBank (U28.7)
SPI2_#CS6: FPGA Connect (CON5.37), RTDBank (U21.7)
SPI2_DOUT: Seed Laser Controller (U37.6), FPGA Connect (CON5.40), RTDBank (6 pins)
SPI2_SCLK: Seed Laser Controller (U37.8), FPGA Connect (CON5.39), RTDBank (6 pins)
SPI3_CS: Seed Laser Controller (U35.5), FPGA Connect (CON5.29)
SPI3_MOSI: Seed Laser Controller (U35.3), FPGA Connect (CON5.27)
SPI3_RESET: Seed Laser Controller (U35.6), FPGA Connect (CON5.30)
SPI3_SCLK: Seed Laser Controller (U35.4), FPGA Connect (CON5.28)
TEC_SETPOINT: Seed Laser Controller (U24.2), FPGA Connect (R43.2 R61.1)
VSET: Seed Laser Controller (9 pins), FPGA Connect (C44.1 U6.12)